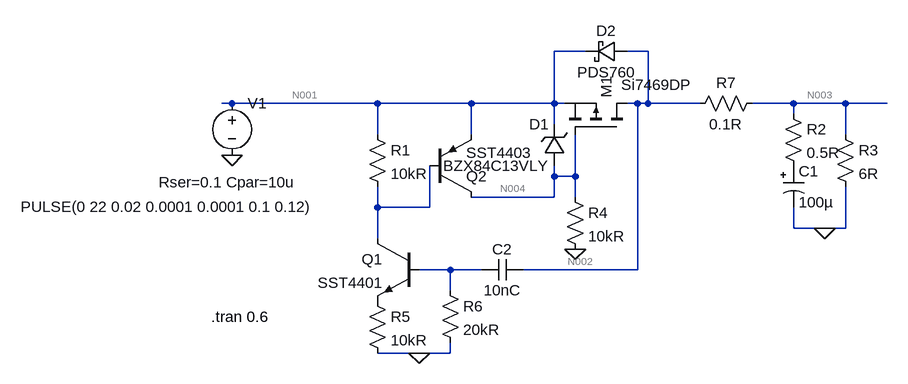
[diagram p0: schematic SoftStart.asc]
SoftStart.asc, the LTspice schematic file:
Version 4
SHEET 1 880 696
WIRE 112 80 64 80
WIRE 208 80 176 80
WIRE -432 160 -448 160
WIRE -208 160 -432 160
WIRE -64 160 -208 160
WIRE 64 160 64 80
WIRE 64 160 -64 160
WIRE 80 160 64 160
WIRE 192 160 176 160
WIRE 208 160 208 80
WIRE 208 160 192 160
WIRE 288 160 208 160
WIRE 432 160 368 160
WIRE 512 160 432 160
WIRE 576 160 512 160
WIRE 432 176 432 160
WIRE 64 192 64 160
WIRE -208 208 -208 160
WIRE -64 208 -64 160
WIRE 512 208 512 160
WIRE 64 272 64 256
WIRE 96 272 96 208
WIRE 96 272 64 272
WIRE 64 304 64 272
WIRE 64 304 -64 304
WIRE 96 304 96 272
WIRE -208 320 -208 288
WIRE -128 320 -128 256
WIRE -128 320 -208 320
WIRE 432 352 432 320
WIRE 480 352 432 352
WIRE 512 352 512 288
WIRE 512 352 480 352
WIRE -208 368 -208 320
WIRE -96 416 -144 416
WIRE -48 416 -96 416
WIRE 192 416 192 160
WIRE 192 416 16 416
WIRE -96 448 -96 416
WIRE -144 544 -208 544
WIRE -96 544 -96 528
WIRE -96 544 -144 544
FLAG 480 352 0
FLAG -432 240 0
FLAG 96 384 0
FLAG -144 544 0
SYMBOL pmos 176 208 M270
WINDOW 3 77 9 VLeft 2
SYMATTR InstName M1
SYMATTR Value Si7469DP
SYMBOL polcap 416 256 R0
WINDOW 3 24 56 Left 2
SYMATTR Value 100µ
SYMATTR InstName C1
SYMATTR Description Capacitor
SYMATTR Type cap
SYMATTR SpiceLine V=2 Irms=3 Rser=0.1 Lser=0
SYMBOL res 416 160 R0
SYMATTR InstName R2
SYMATTR Value 0.5R
SYMBOL res 496 192 R0
SYMATTR InstName R3
SYMATTR Value 6R
SYMBOL voltage -432 144 R0
WINDOW 3 -325 175 Left 2
WINDOW 123 0 0 Left 0
WINDOW 39 -113 137 Left 2
SYMATTR Value PULSE(0 22 0.02 0.0001 0.0001 0.1 0.12)
SYMATTR SpiceLine Rser=0.1 Cpar=10u
SYMATTR InstName V1
SYMBOL res -224 192 R0
SYMATTR InstName R1
SYMATTR Value 10kR
SYMBOL npn -144 368 M0
SYMATTR InstName Q1
SYMATTR Value SST4401
SYMBOL pnp -128 304 M180
SYMATTR InstName Q2
SYMATTR Value SST4403
SYMBOL zener 80 256 R180
WINDOW 0 24 64 Left 2
WINDOW 3 24 0 Left 2
SYMATTR InstName D1
SYMATTR Value BZX84C13VLY
SYMATTR Description Diode
SYMATTR Type diode
SYMBOL res 80 288 R0
SYMATTR InstName R4
SYMATTR Value 10kR
SYMBOL res -224 448 R0
SYMATTR InstName R5
SYMATTR Value 10kR
SYMBOL res -112 432 R0
SYMATTR InstName R6
SYMATTR Value 20kR
SYMBOL cap 16 400 R90
WINDOW 0 0 32 VBottom 2
WINDOW 3 32 32 VTop 2
SYMATTR InstName C2
SYMATTR Value 10nC
SYMBOL schottky 176 64 R90
WINDOW 0 0 32 VBottom 2
WINDOW 3 32 32 VTop 2
SYMATTR InstName D2
SYMATTR Value PDS760
SYMATTR Description Diode
SYMATTR Type diode
SYMBOL res 384 144 R90
WINDOW 0 0 56 VBottom 2
WINDOW 3 32 56 VTop 2
SYMATTR InstName R7
SYMATTR Value 0.1R
TEXT -464 488 Left 2 !.tran 0.6

The netlist it stands for:
* SoftStart.asc
M1 N002 N004 N001 N001 Si7469DP
C1 P001 0 100µ V=2 Irms=3 Rser=0.1 Lser=0
R2 N003 P001 0.5R
R3 N003 0 6R
V1 N001 0 PULSE(0 22 0.02 0.0001 0.0001 0.1 0.12) Rser=0.1 Cpar=10u
R1 N001 N005 10kR
Q1 N005 N006 P002 0 SST4401
Q2 N004 N005 N001 0 SST4403
D1 N004 N001 BZX84C13VLY
R4 N004 0 10kR
R5 P002 0 10kR
R6 N006 0 20kR
C2 N002 N006 10nC
D2 N002 N001 PDS760
R7 N003 N002 0.1R
.model D D
.lib standard.dio
.model NPN NPN
.model PNP PNP
.lib standard.bjt
.model NMOS NMOS
.model PMOS PMOS
.lib standard.mos
.tran 0.6
.backanno
.end

* Results of the author's LTspice run, read from the files saved beside the schematic
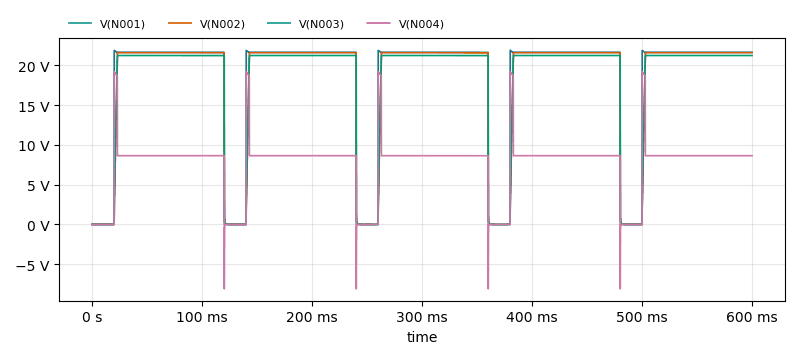
[diagram p1: Transient Analysis of SoftStart.asc, plotted from the saved traces]
* Transient Analysis, 1 run:
*   V(N001): min 0 V, max 21.89 V, average 18.05 V, rms 19.77 V, last 21.65 V
*   V(N002): min 0 V, max 21.59 V, average 17.77 V, rms 19.53 V, last 21.59 V
*   V(N003): min 0 V, max 21.24 V, average 17.48 V, rms 19.21 V, last 21.24 V
*   V(N004): min -8.09 V, max 19.21 V, average 7.454 V, rms 8.322 V, last 8.647 V